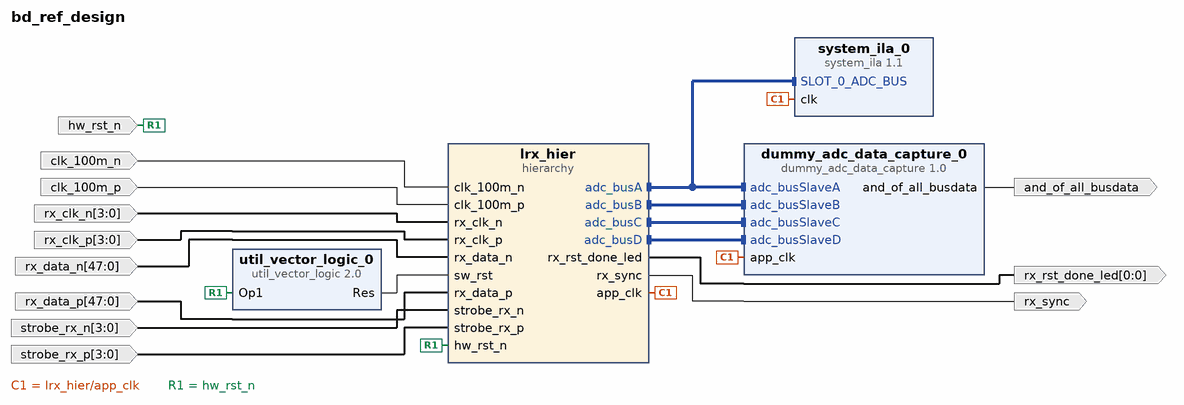
[diagram p0: block diagram of the top level]
# Vivado block design bd_ref_design, xcku060-ffva1517-2-e, Vivado 2025.1
create_bd_design bd_ref_design

create_bd_port -dir I clk_100m_p
create_bd_port -dir I clk_100m_n
create_bd_port -dir I -type rst hw_rst_n
create_bd_port -dir I -from 3 -to 0 rx_clk_p
create_bd_port -dir I -from 3 -to 0 rx_clk_n
create_bd_port -dir I -from 47 -to 0 rx_data_p
create_bd_port -dir I -from 47 -to 0 rx_data_n
create_bd_port -dir I -from 3 -to 0 strobe_rx_p
create_bd_port -dir I -from 3 -to 0 strobe_rx_n
create_bd_port -dir O rx_sync
create_bd_port -dir O -from 0 -to 0 rx_rst_done_led
create_bd_port -dir O and_of_all_busdata

create_bd_cell -type ip -vlnv xilinx.com:ip:util_vector_logic:2.0 util_vector_logic_0
set_property -dict {CONFIG.C_OPERATION not CONFIG.C_SIZE 1} [get_bd_cells util_vector_logic_0]
create_bd_cell -type ip -vlnv ti.com:user:dummy_adc_data_capture:1.0 dummy_adc_data_capture_0
create_bd_cell -type hier lrx_hier
create_bd_cell -type ip -vlnv xilinx.com:ip:system_ila:1.1 system_ila_0
set_property -dict [list \
  CONFIG.C_MON_TYPE INTERFACE \
  CONFIG.C_NUM_MONITOR_SLOTS 1 \
  CONFIG.C_SLOT_0_INTF_TYPE ti.com:user:adc_bus_rtl:1.0 \
  CONFIG.C_SLOT_0_TYPE 0 \
] [get_bd_cells system_ila_0]

# ---- hierarchy /lrx_hier ----
current_bd_instance /lrx_hier
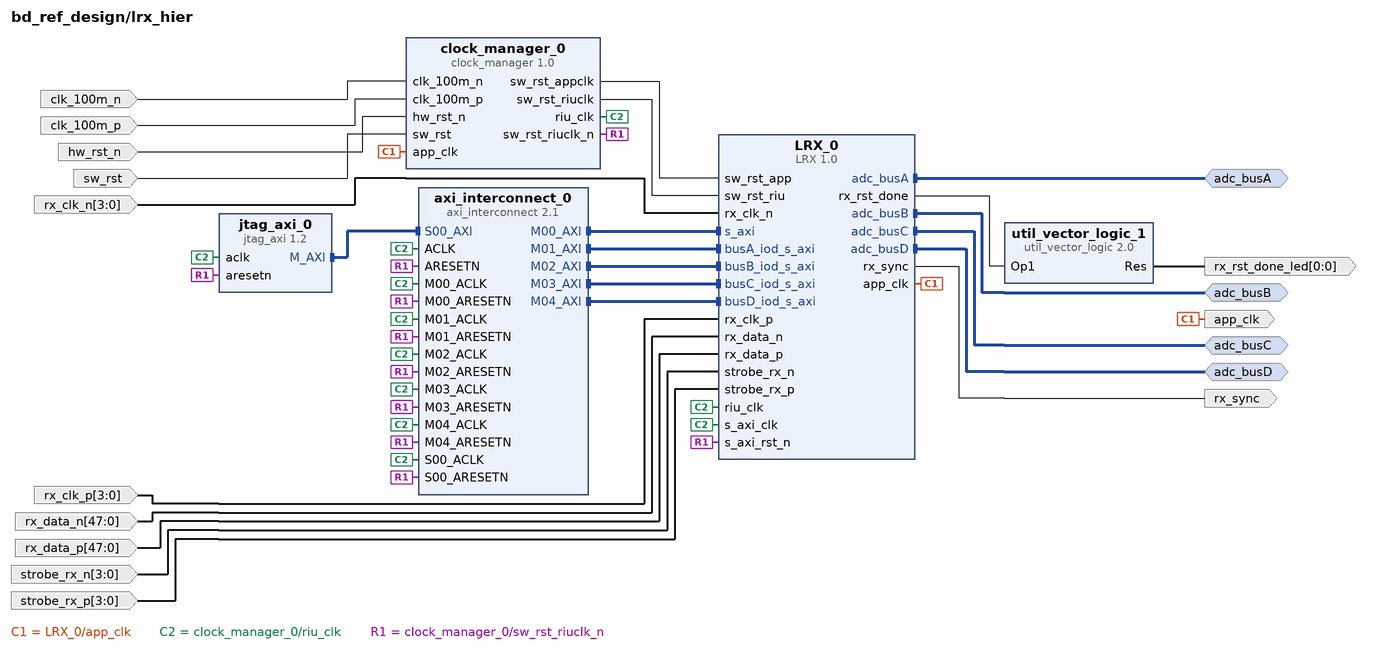
[diagram p1: block diagram inside /lrx_hier]
create_bd_intf_pin -mode Master -vlnv ti.com:user:adc_bus_rtl:1.0 adc_busA
create_bd_intf_pin -mode Master -vlnv ti.com:user:adc_bus_rtl:1.0 adc_busB
create_bd_intf_pin -mode Master -vlnv ti.com:user:adc_bus_rtl:1.0 adc_busC
create_bd_intf_pin -mode Master -vlnv ti.com:user:adc_bus_rtl:1.0 adc_busD
create_bd_pin -dir O -from 0 -to 0 rx_rst_done_led
create_bd_pin -dir I clk_100m_p
create_bd_pin -dir I clk_100m_n
create_bd_pin -dir I -type rst hw_rst_n
create_bd_pin -dir I -type rst sw_rst
create_bd_pin -dir O -type clk app_clk
create_bd_pin -dir I -from 3 -to 0 rx_clk_p
create_bd_pin -dir I -from 3 -to 0 rx_clk_n
create_bd_pin -dir I -from 47 -to 0 rx_data_p
create_bd_pin -dir I -from 47 -to 0 rx_data_n
create_bd_pin -dir I -from 3 -to 0 strobe_rx_p
create_bd_pin -dir I -from 3 -to 0 strobe_rx_n
create_bd_pin -dir O rx_sync

create_bd_cell -type ip -vlnv xilinx.com:ip:jtag_axi:1.2 jtag_axi_0
create_bd_cell -type ip -vlnv xilinx.com:ip:util_vector_logic:2.0 util_vector_logic_1
set_property -dict {CONFIG.C_OPERATION not CONFIG.C_SIZE 1} [get_bd_cells util_vector_logic_1]
create_bd_cell -type ip -vlnv ti.com:user:clock_manager:1.0 clock_manager_0
set_property -dict {CONFIG.FAN_OUT_SW_RST_APPCLK 0x0078 CONFIG.FAN_OUT_SW_RST_RIUCLK 0x0008} [get_bd_cells clock_manager_0]
create_bd_cell -type ip -vlnv ti.com:user:LRX:1.0 LRX_0
create_bd_cell -type ip -vlnv xilinx.com:ip:axi_interconnect:2.1 axi_interconnect_0
set_property -dict {CONFIG.NUM_MI 5} [get_bd_cells axi_interconnect_0]

# ---- connections ----

current_bd_instance /lrx_hier
connect_bd_intf_net -intf_net LRX_0_adc_busA [get_bd_intf_pins adc_busA] [get_bd_intf_pins LRX_0/adc_busA]
connect_bd_intf_net -intf_net LRX_0_adc_busB [get_bd_intf_pins adc_busB] [get_bd_intf_pins LRX_0/adc_busB]
connect_bd_intf_net -intf_net LRX_0_adc_busC [get_bd_intf_pins adc_busC] [get_bd_intf_pins LRX_0/adc_busC]
connect_bd_intf_net -intf_net LRX_0_adc_busD [get_bd_intf_pins adc_busD] [get_bd_intf_pins LRX_0/adc_busD]
connect_bd_intf_net [get_bd_intf_pins LRX_0/s_axi] [get_bd_intf_pins axi_interconnect_0/M00_AXI]
connect_bd_intf_net [get_bd_intf_pins LRX_0/busA_iod_s_axi] [get_bd_intf_pins axi_interconnect_0/M01_AXI]
connect_bd_intf_net [get_bd_intf_pins LRX_0/busB_iod_s_axi] [get_bd_intf_pins axi_interconnect_0/M02_AXI]
connect_bd_intf_net [get_bd_intf_pins LRX_0/busC_iod_s_axi] [get_bd_intf_pins axi_interconnect_0/M03_AXI]
connect_bd_intf_net [get_bd_intf_pins LRX_0/busD_iod_s_axi] [get_bd_intf_pins axi_interconnect_0/M04_AXI]
connect_bd_intf_net [get_bd_intf_pins jtag_axi_0/M_AXI] [get_bd_intf_pins axi_interconnect_0/S00_AXI]
connect_bd_net [get_bd_pins LRX_0/app_clk] [get_bd_pins app_clk] [get_bd_pins clock_manager_0/app_clk]
connect_bd_net [get_bd_pins LRX_0/rx_rst_done] [get_bd_pins util_vector_logic_1/Op1]
connect_bd_net -net LRX_0_rx_sync [get_bd_pins LRX_0/rx_sync] [get_bd_pins rx_sync]
connect_bd_net [get_bd_pins clk_100m_n] [get_bd_pins clock_manager_0/clk_100m_n]
connect_bd_net [get_bd_pins clk_100m_p] [get_bd_pins clock_manager_0/clk_100m_p]
connect_bd_net [get_bd_pins clock_manager_0/riu_clk] \
  [get_bd_pins jtag_axi_0/aclk] [get_bd_pins LRX_0/riu_clk] [get_bd_pins LRX_0/s_axi_clk] \
  [get_bd_pins axi_interconnect_0/ACLK] [get_bd_pins axi_interconnect_0/S00_ACLK] [get_bd_pins axi_interconnect_0/M00_ACLK] \
  [get_bd_pins axi_interconnect_0/M02_ACLK] [get_bd_pins axi_interconnect_0/M01_ACLK] \
  [get_bd_pins axi_interconnect_0/M03_ACLK] [get_bd_pins axi_interconnect_0/M04_ACLK]
connect_bd_net [get_bd_pins clock_manager_0/sw_rst_appclk] [get_bd_pins LRX_0/sw_rst_app]
connect_bd_net [get_bd_pins clock_manager_0/sw_rst_riuclk] [get_bd_pins LRX_0/sw_rst_riu]
connect_bd_net [get_bd_pins clock_manager_0/sw_rst_riuclk_n] \
  [get_bd_pins jtag_axi_0/aresetn] [get_bd_pins axi_interconnect_0/ARESETN] [get_bd_pins axi_interconnect_0/S00_ARESETN] \
  [get_bd_pins axi_interconnect_0/M00_ARESETN] [get_bd_pins axi_interconnect_0/M01_ARESETN] \
  [get_bd_pins axi_interconnect_0/M02_ARESETN] [get_bd_pins axi_interconnect_0/M03_ARESETN] \
  [get_bd_pins axi_interconnect_0/M04_ARESETN] [get_bd_pins LRX_0/s_axi_rst_n]
connect_bd_net [get_bd_pins hw_rst_n] [get_bd_pins clock_manager_0/hw_rst_n]
connect_bd_net [get_bd_pins rx_clk_n] [get_bd_pins LRX_0/rx_clk_n]
connect_bd_net [get_bd_pins rx_clk_p] [get_bd_pins LRX_0/rx_clk_p]
connect_bd_net [get_bd_pins rx_data_n] [get_bd_pins LRX_0/rx_data_n]
connect_bd_net [get_bd_pins rx_data_p] [get_bd_pins LRX_0/rx_data_p]
connect_bd_net [get_bd_pins strobe_rx_n] [get_bd_pins LRX_0/strobe_rx_n]
connect_bd_net [get_bd_pins strobe_rx_p] [get_bd_pins LRX_0/strobe_rx_p]
connect_bd_net -net util_vector_logic_0_Res [get_bd_pins sw_rst] [get_bd_pins clock_manager_0/sw_rst]
connect_bd_net [get_bd_pins util_vector_logic_1/Res] [get_bd_pins rx_rst_done_led]
set_property HDL_ATTRIBUTE.DEBUG true [get_bd_intf_nets LRX_0_adc_busA]
set_property HDL_ATTRIBUTE.DEBUG true [get_bd_intf_nets LRX_0_adc_busB]
set_property HDL_ATTRIBUTE.DEBUG true [get_bd_intf_nets LRX_0_adc_busC]
set_property HDL_ATTRIBUTE.DEBUG true [get_bd_intf_nets LRX_0_adc_busD]
set_property HDL_ATTRIBUTE.DEBUG true [get_bd_nets LRX_0_rx_sync]

current_bd_instance /
connect_bd_intf_net -intf_net LRX_0_adc_busA [get_bd_intf_pins lrx_hier/adc_busA] [get_bd_intf_pins dummy_adc_data_capture_0/adc_busSlaveA]
connect_bd_intf_net [get_bd_intf_pins lrx_hier/adc_busA] [get_bd_intf_pins system_ila_0/SLOT_0_ADC_BUS]
connect_bd_intf_net -intf_net LRX_0_adc_busB [get_bd_intf_pins lrx_hier/adc_busB] [get_bd_intf_pins dummy_adc_data_capture_0/adc_busSlaveB]
connect_bd_intf_net -intf_net LRX_0_adc_busC [get_bd_intf_pins lrx_hier/adc_busC] [get_bd_intf_pins dummy_adc_data_capture_0/adc_busSlaveC]
connect_bd_intf_net -intf_net LRX_0_adc_busD [get_bd_intf_pins lrx_hier/adc_busD] [get_bd_intf_pins dummy_adc_data_capture_0/adc_busSlaveD]
connect_bd_net -net LRX_0_app_clk [get_bd_pins lrx_hier/app_clk] [get_bd_pins dummy_adc_data_capture_0/app_clk] [get_bd_pins system_ila_0/clk]
connect_bd_net -net LRX_0_rx_sync [get_bd_pins lrx_hier/rx_sync] [get_bd_ports rx_sync]
connect_bd_net [get_bd_ports clk_100m_n] [get_bd_pins lrx_hier/clk_100m_n]
connect_bd_net [get_bd_ports clk_100m_p] [get_bd_pins lrx_hier/clk_100m_p]
connect_bd_net [get_bd_pins dummy_adc_data_capture_0/and_of_all_busdata] [get_bd_ports and_of_all_busdata]
connect_bd_net [get_bd_ports hw_rst_n] [get_bd_pins util_vector_logic_0/Op1] [get_bd_pins lrx_hier/hw_rst_n]
connect_bd_net [get_bd_ports rx_clk_n] [get_bd_pins lrx_hier/rx_clk_n]
connect_bd_net [get_bd_ports rx_clk_p] [get_bd_pins lrx_hier/rx_clk_p]
connect_bd_net [get_bd_ports rx_data_n] [get_bd_pins lrx_hier/rx_data_n]
connect_bd_net [get_bd_ports rx_data_p] [get_bd_pins lrx_hier/rx_data_p]
connect_bd_net [get_bd_ports strobe_rx_n] [get_bd_pins lrx_hier/strobe_rx_n]
connect_bd_net [get_bd_ports strobe_rx_p] [get_bd_pins lrx_hier/strobe_rx_p]
connect_bd_net [get_bd_pins util_vector_logic_0/Res] [get_bd_pins lrx_hier/sw_rst]
connect_bd_net -net util_vector_logic_1_Res [get_bd_pins lrx_hier/rx_rst_done_led] [get_bd_ports rx_rst_done_led]
set_property HDL_ATTRIBUTE.DEBUG true [get_bd_intf_nets LRX_0_adc_busA]
set_property HDL_ATTRIBUTE.MARK_DEBUG true [get_bd_intf_nets LRX_0_adc_busA]
set_property HDL_ATTRIBUTE.DEBUG true [get_bd_intf_nets LRX_0_adc_busB]
set_property HDL_ATTRIBUTE.MARK_DEBUG true [get_bd_intf_nets LRX_0_adc_busB]
set_property HDL_ATTRIBUTE.DEBUG true [get_bd_intf_nets LRX_0_adc_busC]
set_property HDL_ATTRIBUTE.MARK_DEBUG true [get_bd_intf_nets LRX_0_adc_busC]
set_property HDL_ATTRIBUTE.DEBUG true [get_bd_intf_nets LRX_0_adc_busD]
set_property HDL_ATTRIBUTE.MARK_DEBUG true [get_bd_intf_nets LRX_0_adc_busD]
set_property HDL_ATTRIBUTE.DEBUG true [get_bd_nets LRX_0_rx_sync]
set_property HDL_ATTRIBUTE.MARK_DEBUG true [get_bd_nets LRX_0_rx_sync]

# ---- address map ----
assign_bd_address -offset 0x00000000 -range 512M -target_address_space [get_bd_addr_spaces lrx_hier/jtag_axi_0/Data] [get_bd_addr_segs lrx_hier/LRX_0/busA_iod_s_axi/reg0]
assign_bd_address -offset 0x20000000 -range 512M -target_address_space [get_bd_addr_spaces lrx_hier/jtag_axi_0/Data] [get_bd_addr_segs lrx_hier/LRX_0/busB_iod_s_axi/reg0]
assign_bd_address -offset 0x40000000 -range 512M -target_address_space [get_bd_addr_spaces lrx_hier/jtag_axi_0/Data] [get_bd_addr_segs lrx_hier/LRX_0/busC_iod_s_axi/reg0]
assign_bd_address -offset 0x60000000 -range 512M -target_address_space [get_bd_addr_spaces lrx_hier/jtag_axi_0/Data] [get_bd_addr_segs lrx_hier/LRX_0/busD_iod_s_axi/reg0]
assign_bd_address -offset 0x80000000 -range 512M -target_address_space [get_bd_addr_spaces lrx_hier/jtag_axi_0/Data] [get_bd_addr_segs lrx_hier/LRX_0/s_axi/reg0]

validate_bd_design
save_bd_design
